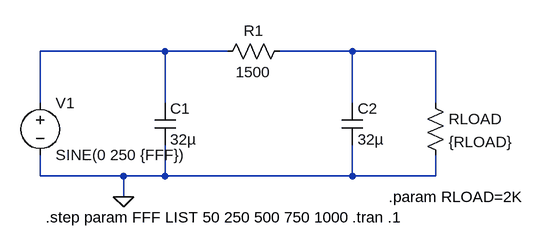
[diagram p0: schematic R_PI_Filter1.asc]
R_PI_Filter1.asc, the LTspice schematic file:
Version 4
SHEET 1 880 680
WIRE 128 64 -64 64
WIRE 224 64 128 64
WIRE 416 64 304 64
WIRE 544 64 416 64
WIRE -64 144 -64 64
WIRE 128 144 128 64
WIRE 416 144 416 64
WIRE 544 144 544 64
WIRE -64 256 -64 224
WIRE 64 256 -64 256
WIRE 128 256 128 208
WIRE 128 256 64 256
WIRE 416 256 416 208
WIRE 416 256 128 256
WIRE 544 256 544 224
WIRE 544 256 416 256
WIRE 64 288 64 256
FLAG 64 288 0
SYMBOL voltage -64 128 R0
WINDOW 123 0 0 Left 0
WINDOW 39 0 0 Left 0
SYMATTR InstName V1
SYMATTR Value SINE(0 250 {FFF})
SYMBOL res 320 48 R90
WINDOW 0 0 56 VBottom 2
WINDOW 3 32 56 VTop 2
SYMATTR InstName R1
SYMATTR Value 1500
SYMBOL cap 112 144 R0
SYMATTR InstName C1
SYMATTR Value 32µ
SYMBOL cap 400 144 R0
SYMATTR InstName C2
SYMATTR Value 32µ
SYMBOL res 528 128 R0
SYMATTR InstName RLOAD
SYMATTR Value {RLOAD}
TEXT 472 288 Left 2 !.param RLOAD=2K
TEXT -56 320 Left 2 !.step param FFF LIST 50 250 500 750 1000
TEXT 416 320 Left 2 !.tran .1

The netlist it stands for:
* R_PI_Filter1.asc
V1 N001 0 SINE(0 250 {FFF})
R1 N002 N001 1500
C1 N001 0 32µ
C2 N002 0 32µ
RLOAD N002 0 {RLOAD}
.param RLOAD=2K
.step param FFF LIST 50 250 500 750 1000
.tran .1
.backanno
.end